# Altium project FEEL_2021.PrjPcb
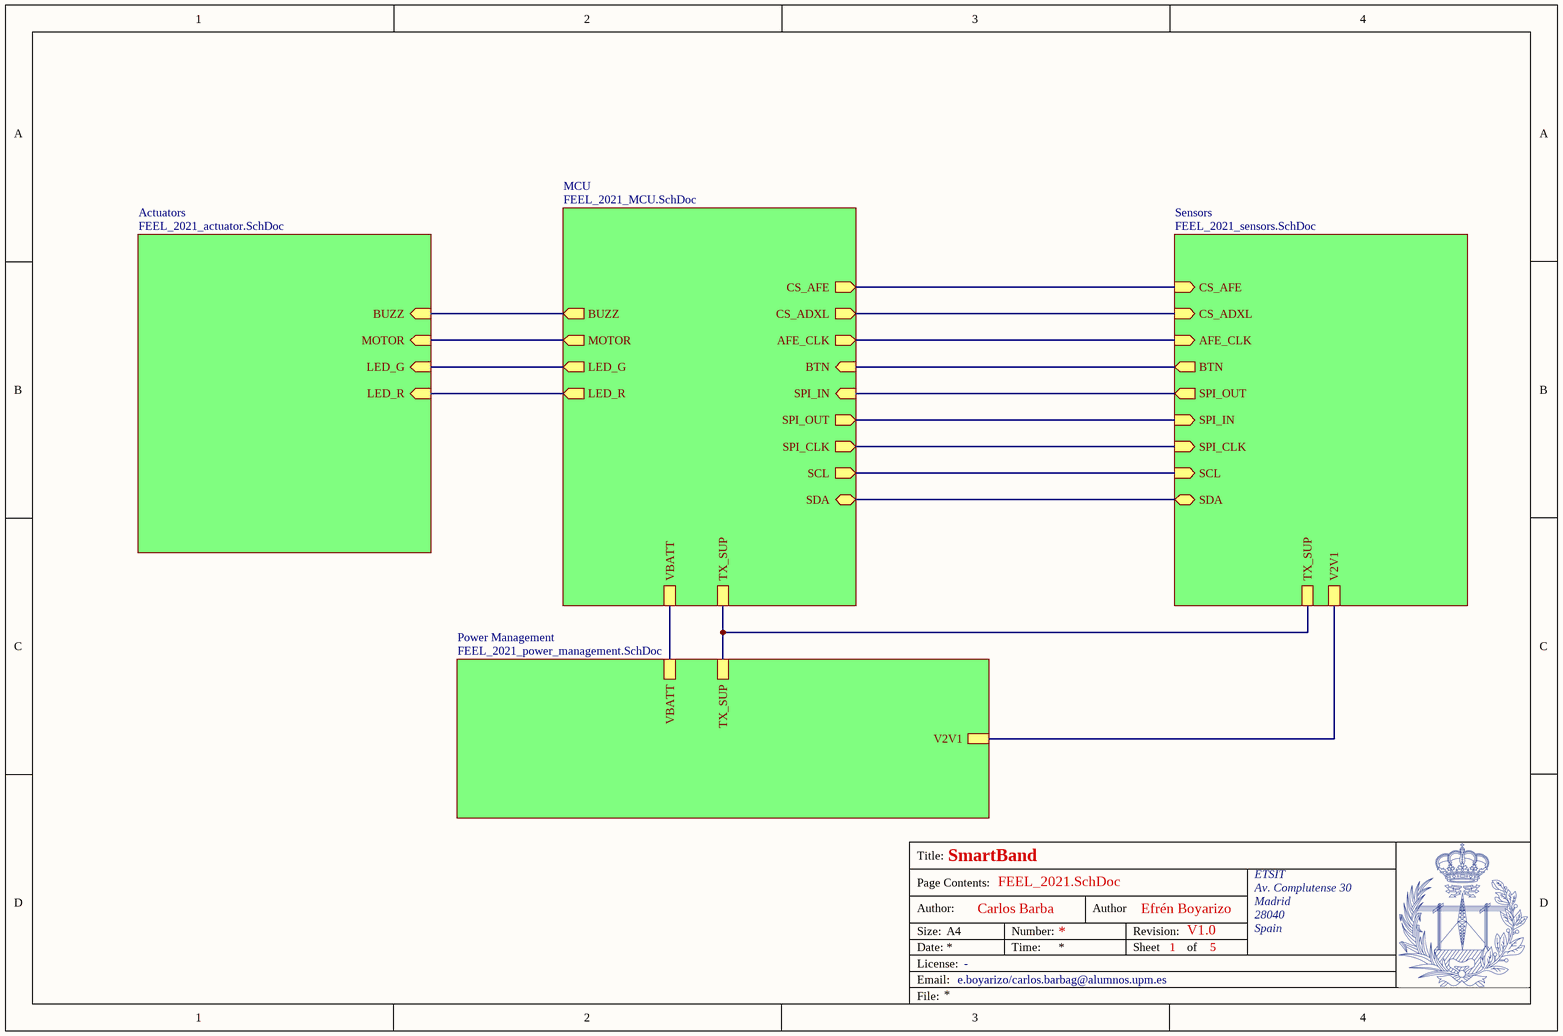
[diagram p0: FEEL_2021.SchDoc]
5 sheets, 64 parts. Net scope: hierarchical (ports join the sheet entries above them; power ports are global).
Board file: FEEL_2021.PcbDoc
Sheets:
  FEEL_2021.SchDoc
    Power Management = FEEL_2021_power_management.SchDoc
    MCU = FEEL_2021_MCU.SchDoc
    Sensors = FEEL_2021_sensors.SchDoc
    Actuators = FEEL_2021_actuator.SchDoc

## Sheet FEEL_2021.SchDoc: FEEL 2021
size A4; CheckedBy: -; Author: Carlos Barba, Efrén Boyarizo; CompanyName: ETSIT; DrawnBy: -; Revision: V1.0; SheetNumber: 1; SheetTotal: 5

### Sub-sheets
Actuators = FEEL_2021_actuator.SchDoc: MOTOR (in), LED_G (in), LED_R (in), BUZZ (in)
MCU = FEEL_2021_MCU.SchDoc: SDA (bidir), SCL (out), SPI_CLK (out), SPI_OUT (out), SPI_IN (in), AFE_CLK (out), CS_ADXL (out), VBATT, TX_SUP, BTN (in), LED_G (out), LED_R (out), MOTOR (out), BUZZ (out), CS_AFE (out)
Power Management = FEEL_2021_power_management.SchDoc: TX_SUP, VBATT, V2V1
Sensors = FEEL_2021_sensors.SchDoc: SDA (bidir), SCL (in), SPI_CLK (in), SPI_IN (in), SPI_OUT (out), AFE_CLK (in), CS_ADXL (in), V2V1, BTN (out), TX_SUP, CS_AFE (in)

### Nets
VDD: sheet Power Management/V2V1, sheet Sensors/V2V1
SCL: sheet MCU/SCL, sheet Sensors/SCL
SDA: sheet MCU/SDA, sheet Sensors/SDA
SPI_CLK: sheet MCU/SPI_CLK, sheet Sensors/SPI_CLK
SPI_IN: sheet MCU/SPI_OUT, sheet Sensors/SPI_IN
SPI_OUT: sheet MCU/SPI_IN, sheet Sensors/SPI_OUT
TX_SUP: sheet Power Management/TX_SUP, sheet MCU/TX_SUP, sheet Sensors/TX_SUP
NetADXL1_8: sheet MCU/CS_ADXL, sheet Sensors/CS_ADXL
NetBUZZ1_1: sheet MCU/BUZZ, sheet Actuators/BUZZ
NetC1_2: sheet Power Management/VBATT, sheet MCU/VBATT
NetM1_1: sheet MCU/MOTOR, sheet Actuators/MOTOR
NetMCU1_15: sheet MCU/AFE_CLK, sheet Sensors/AFE_CLK
NetMCU1_16: sheet MCU/CS_AFE, sheet Sensors/CS_AFE
NetMCU1_21: sheet MCU/BTN, sheet Sensors/BTN
NetMCU1_24: sheet MCU/LED_G, sheet Actuators/LED_G
NetMCU1_25: sheet MCU/LED_R, sheet Actuators/LED_R

### Notes on the sheet
- Title:
- SmartBand
- Author:
- Page Contents:
- Carlos Barba
- Author
- Efrén Boyarizo
- V1.0
- ETSIT
- Av. Complutense 30
- Madrid
- 28040
- Size:
- Date:
- File:
- License:
- Email:
- A4
- e.boyarizo/carlos.barbag@alumnos.upm.es
- -
- Number:
- Time:
- Revision:
- Sheet
- of
- 5
- Spain

## Sheet FEEL_2021_power_management.SchDoc
size A4; SheetNumber: 2; SheetTotal: 5
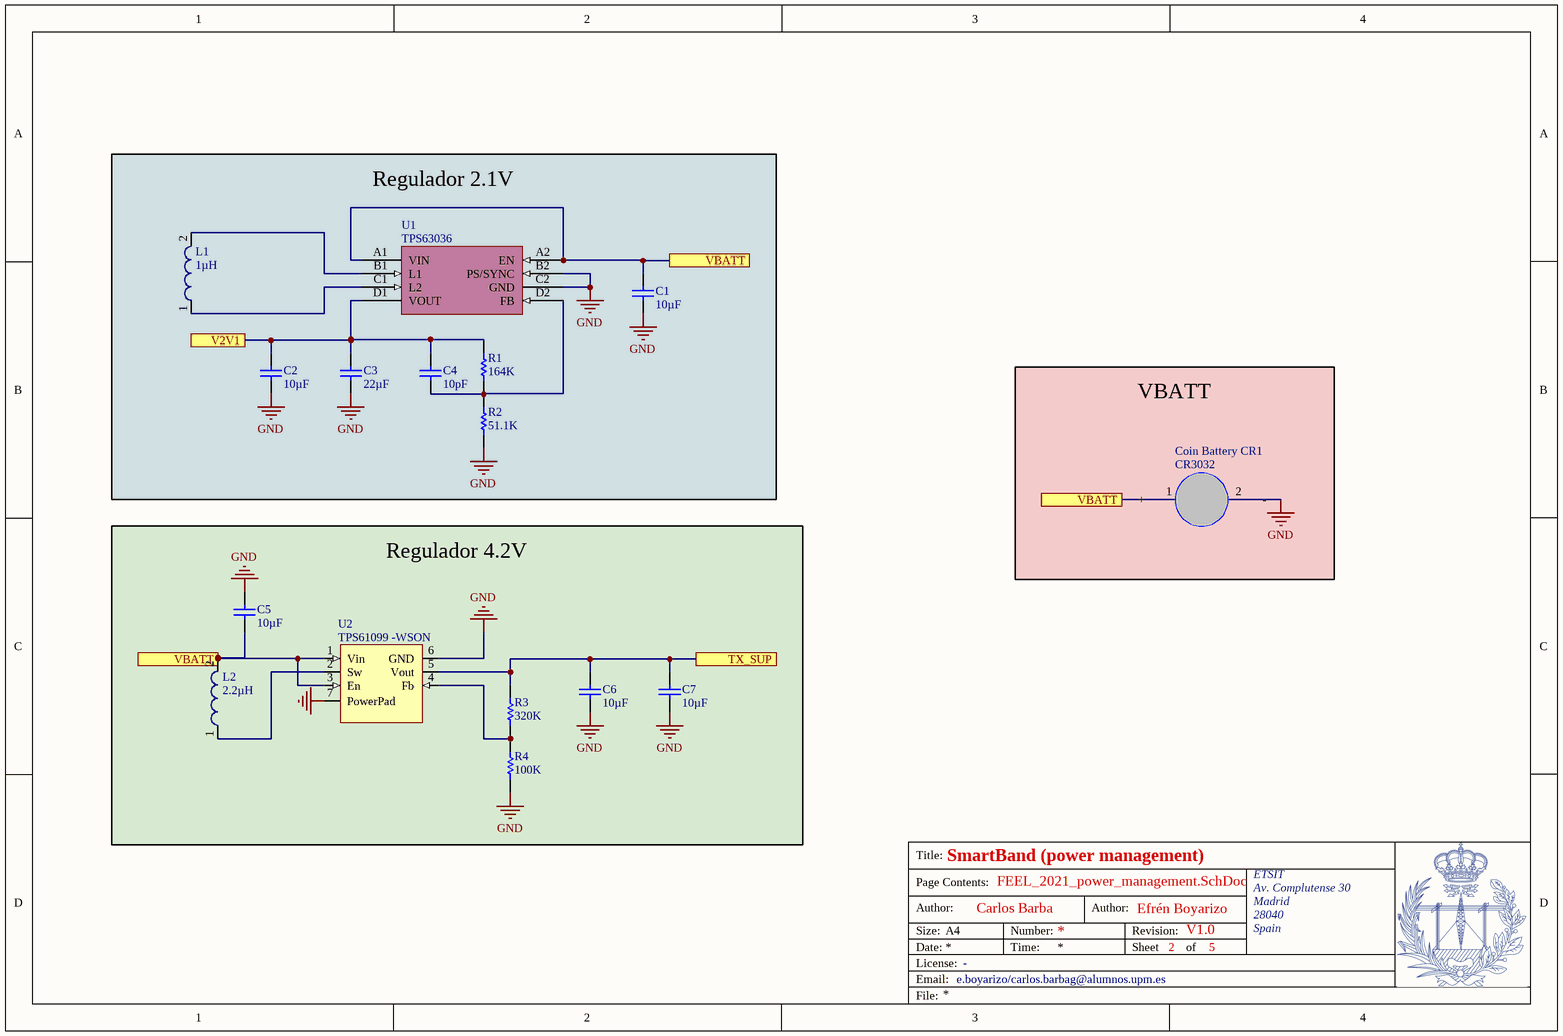
[diagram p1: FEEL_2021_power_management.SchDoc]

### Parts
C1  10µF  [CAPC1608X90X35ML10T15]
C2  10µF  [CAPC1608X90X35ML10T15]
C3  22µF  [CAPC1608X90X35ML10T15]
C4  10pF  [CAPC1608X90X35ML10T15]
C5  10µF  [CAPC1608X90X35ML10T15]
C6  10µF  [CAPC1608X90X35ML10T15]
C7  10µF  [CAPC1608X90X35ML10T15]
Coin_Battery_CR1  (no value)  [CR3032]
L1  1µH  [SMD 2510]
L2  2.2µH  [SMD 2510]
R1  164K  [RESC1609X50X30NL8T20]
R2  51.1K  [RESC1609X50X30NL8T20]
R3  320K  [RESC1609X50X30NL8T20]
R4  100K  [RESC1609X50X30NL8T20]
U1  (no value)  [tps63036]
U2  (no value)  [SOP6]

### Ports
TX_SUP, V2V1, VBATT

### Nets
GND: C1.1 C2.1 C3.1 C5.2 C6.1 C7.1 Coin_Battery_CR1.2(-) R2.2 R4.2 U1.B2(PS/SYNC) U1.C2(GND) U2.6(GND) U2.7(PowerPad)
VDD: C2.2 C3.2 C4.2 R1.2 U1.D1(VOUT) ; port V2V1
TX_SUP: C6.2 C7.2 R3.1 U2.5(Vout) ; port TX_SUP
NetC1_2: C1.2 C5.1 Coin_Battery_CR1.1(+) L2.2 U1.A1(VIN) U1.A2(EN) U2.1(Vin) U2.3(En) ; port VBATT
NetC4_1: C4.1 R1.1 R2.1 U1.D2(FB)
NetL1_1: L1.1 U1.C1(L2)
NetL1_2: L1.2 U1.B1(L1)
NetL2_1: L2.1 U2.2(Sw)
NetR3_2: R3.2 R4.1 U2.4(Fb)

### Notes on the sheet
- Regulador 2.1V
- (near Coin_Battery_CR1) VBATT
- Regulador 4.2V
- Title:
- SmartBand (power management)
- Author:
- Page Contents:
- Carlos Barba
- Efrén Boyarizo
- V1.0
- ETSIT
- Av. Complutense 30
- Madrid
- 28040
- Size:
- Date:
- File:
- License:
- Email:
- A4
- e.boyarizo/carlos.barbag@alumnos.upm.es
- -
- Number:
- Time:
- Revision:
- Sheet
- of
- 5
- Spain
- (in symbol TSP61099-WSON) TPS61099 -WSON

### Library data of the parts
C1-C7 = CMP-2000-04945-1: Manufacturer: Murata; Capacitance: 22pF; Tolerance (%): ±5%; Rated Voltage: 50V; Dielectric: C0G; Manufacturer URL: http://www.murata.com/; Datasheet Version: Jul-06; Package Reference: 603; Case Size/Dimension: 0603; Package Description: 2-Pin Surface Mount Device, Body 1.6 x 0.8 mm; Datasheet URL: https://datasheet.ciiva.com/11786/0900766b807a1cab-11786398.pdf
Coin_Battery_CR1 = CR3032
L1 L2 = CMP-1411-00017-1: Power Multilayer Inductor WE-MAPI, L=10.0µH; PartNumber: 74438323100; Manufacturer: Wuerth Elektronik; Inductance: 10.0ÂµH; ComponentLink1URL: http://www.we-online.com; ComponentLink2Description: Datasheet; ComponentLink1Description: Manufacturer URL; PackageReference: SMD 2510; ComponentLink2URL: http://katalog.we-online.de/kataloge/eisos/media/pdf/74438323100.pdf
R1-R4 = CMP-2000-03816-5: Chip Resistor, 0 Ohm, Jumper, 100 mW, -55 to 155 degC, 0603 (1608 Metric), RoHS, Tape and Reel; Manufacturer: Vishay Semiconductor; Voltage Rating: 75 V; Package Quantity: 5000; DatasheetVersion: 06/2012; Min Operating Temperature: -55 degC; ComponentLink1URL: http://www.vishay.com/; Mounting Technology: Surface Mount; Height: 0.45 mm; ComponentLink1Description: Manufacturer URL; REACH SVHC: Unknown; PackageReference: 0603; Packaging: Tape and Reel; Max Operating Temperature: 155 degC; Mount: Surface Mount; ComponentLink2Description: Datasheet; PackageDescription: 2-Pin Surface Mount Device, Body 1.575 x 0.85 mm; Length: 1.55 mm; ComponentLink2URL: http://www.vishay.com/docs/20035/dcrcwe3.pdf; Pins: 2; RoHSCompliant: true
U1 = TPS63036: Non-inverting buck-boost / converter able to provide a regulated output voltage / from an input supply that can be higher or lower than / the output voltage
U2 = TSP61099-WSON

## Sheet FEEL_2021_MCU.SchDoc
size A4; SheetNumber: 3; SheetTotal: 5
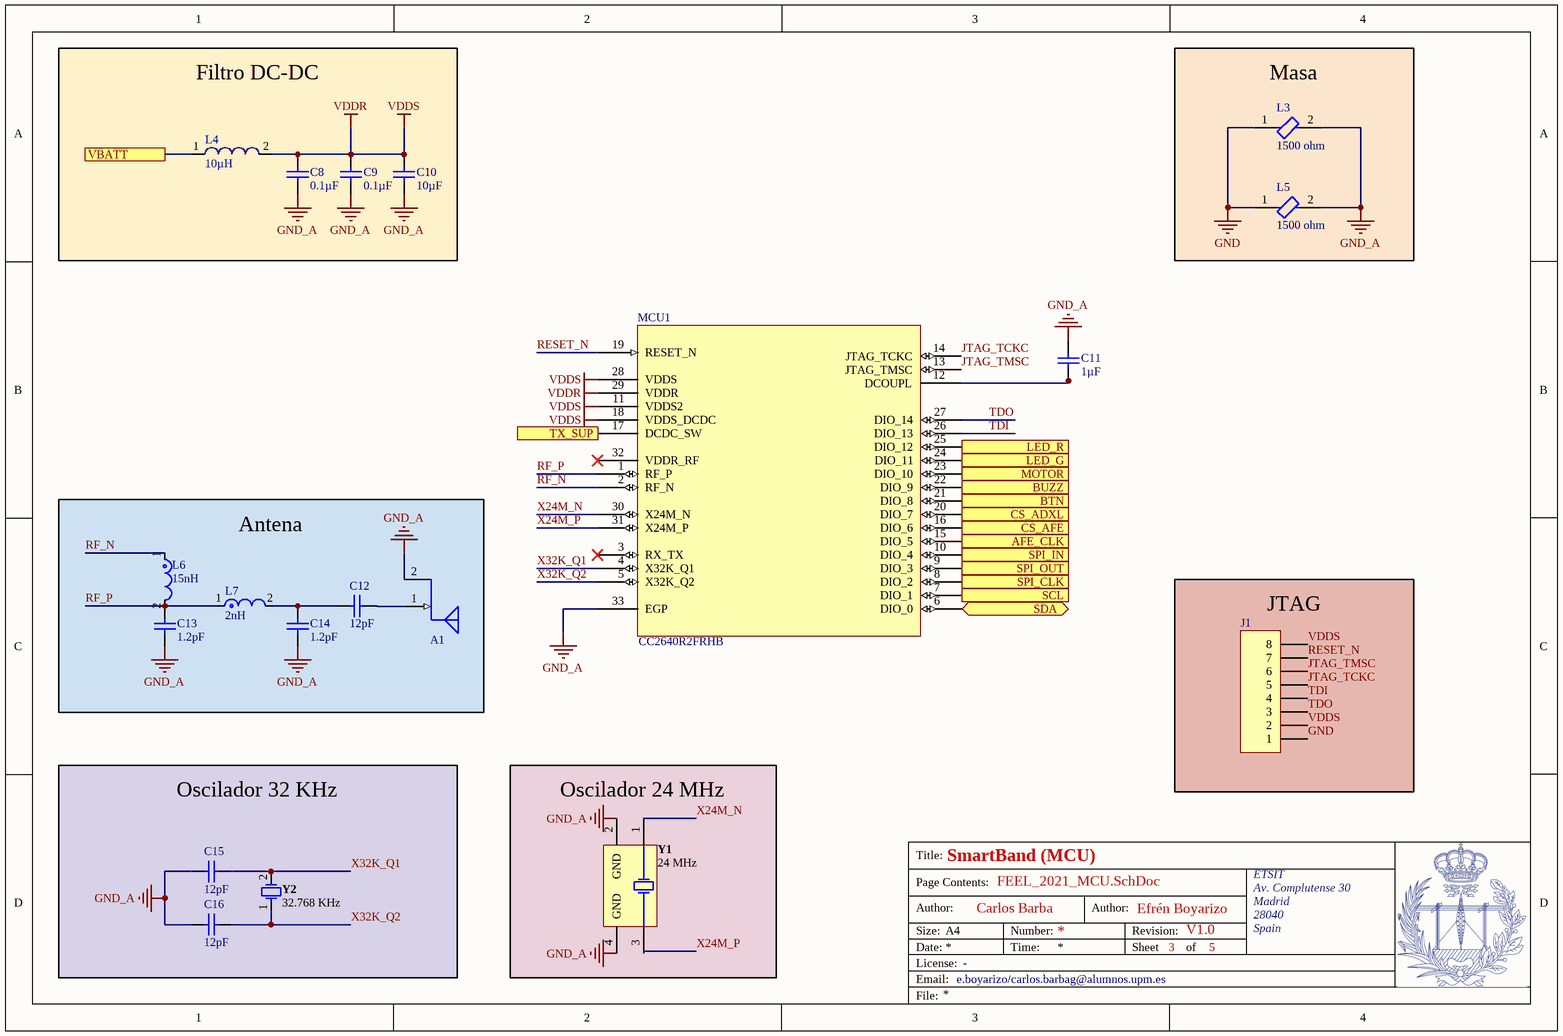
[diagram p2: FEEL_2021_MCU.SchDoc]

### Parts
A1  -  [PCBAntenna]  (value not drawn)  (net tie, no BOM)
C8  0.1µF  [CAPC1608X90X35ML10T15]
C9  0.1µF  [CAPC1608X90X35ML10T15]
C10  10µF  [CAPC1608X90X35ML10T15]
C11  1µF  [CAPC1608X90X35ML10T15]
C12  12pF  [CAPC1608X90X35ML10T15]
C13  1.2pF  [CAPC1608X90X35ML10T15]
C14  1.2pF  [CAPC1608X90X35ML10T15]
C15  12pF  [CAPC1608X90X35ML10T15]
C16  12pF  [CAPC1608X90X35ML10T15]
J1  (no value)  [HDR1X8]
L3  1500 ohm  [FP-BLM18-0_15-t0_8-MFG]
L4  10µH  [SMD 2510]
L5  1500 ohm  [FP-BLM18-0_15-t0_8-MFG]
L6  15nH  [FP-LQG15HH_02-IPC_B]
L7  2nH  [FP-LQG15HH_02-IPC_B]
MCU1  (no value)  [DEOP2021-Calle-Payno]
Y1  24 MHz  [ABRA-ABM3B-4_V]
Y2  32.768 KHz  [ABRA-ABS07_A_V]

### Ports
AFE_CLK (out), BTN (in), BUZZ (out), CS_ADXL (out), CS_AFE (out), LED_G (out), LED_R (out), MOTOR (out), SCL (out), SDA (bidir), SPI_CLK (out), SPI_IN (in), SPI_OUT (out), TX_SUP, VBATT

### Nets
GND: J1.1 L3.1 L5.1
GND_A: A1.2(GND) C8.1 C9.1 C10.1 C11.2 C13.1 C14.1 C15.1 C16.1 L3.2 L5.2 MCU1.33(EGP) Y1.2(GND) Y1.4(GND)
VDDS: C8.2 C9.2 C10.2 J1.2 J1.8 L4.2 MCU1.11(VDDS2) MCU1.18(VDDS_DCDC) MCU1.28(VDDS) MCU1.29(VDDR)  [also labelled VDDR]
JTAG_TCKC: J1.5 MCU1.14(JTAG_TCKC)
JTAG_TMSC: J1.6 MCU1.13(JTAG_TMSC)
RESET_N: J1.7 MCU1.19(RESET_N)
RF_N: L6.1 MCU1.2(RF_N)
RF_P: C13.2 L6.2 L7.1 MCU1.1(RF_P)
SCL: MCU1.7(DIO_1) ; port SCL
SDA: MCU1.6(DIO_0) ; port SDA
SPI_CLK: MCU1.8(DIO_2) ; port SPI_CLK
SPI_IN: MCU1.9(DIO_3) ; port SPI_OUT
SPI_OUT: MCU1.10(DIO_4) ; port SPI_IN
TDI: J1.4 MCU1.26(DIO_13)
TDO: J1.3 MCU1.27(DIO_14)
TX_SUP: MCU1.17(DCDC_SW) ; port TX_SUP
X24M_N: MCU1.30(X24M_N) Y1.1(X1)
X24M_P: MCU1.31(X24M_P) Y1.3(X2)
X32K_Q1: C15.2 MCU1.4(X32K_Q1) Y2.2
X32K_Q2: C16.2 MCU1.5(X32K_Q2) Y2.1
NetA1_1: A1.1(FeedPoint) C12.2
NetADXL1_8: MCU1.20(DIO_7) ; port CS_ADXL
NetBUZZ1_1: MCU1.22(DIO_9) ; port BUZZ
NetC1_2: L4.1 ; port VBATT
NetC11_1: C11.1 MCU1.12(DCOUPL)
NetC12_1: C12.1 C14.2 L7.2
NetM1_1: MCU1.23(DIO_10) ; port MOTOR
NetMCU1_15: MCU1.15(DIO_5) ; port AFE_CLK
NetMCU1_16: MCU1.16(DIO_6) ; port CS_AFE
NetMCU1_21: MCU1.21(DIO_8) ; port BTN
NetMCU1_24: MCU1.24(DIO_11) ; port LED_G
NetMCU1_25: MCU1.25(DIO_12) ; port LED_R

Not connected (* = marked no-connect by the designer): MCU1 3(RX_TX)* 32(VDDR_RF)*

### Notes on the sheet
- Filtro DC-DC
- Masa
- Antena
- (near J1) JTAG
- Title:
- SmartBand (MCU)
- Author:
- Page Contents:
- Carlos Barba
- Efrén Boyarizo
- V1.0
- ETSIT
- Av. Complutense 30
- Madrid
- 28040
- Oscilador 32 KHz
- (near Y1) Oscilador 24 MHz
- Size:
- Date:
- File:
- License:
- Email:
- A4
- e.boyarizo/carlos.barbag@alumnos.upm.es
- -
- Number:
- Time:
- Revision:
- Sheet
- of
- 5
- Spain

### Library data of the parts
A1 = PCBAntenna: GND pin has a via to a GND plane that is not included in the footprint, but has to be included in the final PCB layout design.
C8-C16 = CMP-2000-04945-1: Chip Capacitor, 22 pF, +/- 5%, 50 V, -55 to 125 degC, 0603 (1608 Metric), RoHS, Tape and Reel; Manufacturer: Murata; Capacitance: 22pF; Rated Voltage: 50V; Dielectric: C0G; Manufacturer URL: http://www.murata.com/; Datasheet Version: Jul-06; Package Reference: 603; Tolerance (%): ±5%; Case Size/Dimension: 0603; Package Description: 2-Pin Surface Mount Device, Body 1.6 x 0.8 mm; Datasheet URL: https://datasheet.ciiva.com/11786/0900766b807a1cab-11786398.pdf
J1 = Header 8: Header, 8-Pin; LatestRevisionDate: 17-Jul-2002; LatestRevisionNote: Re-released for DXP Platform.; Publisher: Altium Limited
L3 L5 = CMP-0686-00354-3: Chip Ferrite Bead, 0603, 600Ω @ 100MHz, 0.35Ω, 25%, 500mA; Manufacturer Series: BLM18E; Number of Lines: 1; DC Resistance (DCR): 350mR; Impedance: 600R; Material: Steel; Shielding: Unshielded; Package Quantity: 1; Case/Package: 0603; Length: 1.6mm; Packaging: Tape and Reel; Resistance: 350mR; REACH SVHC: No SVHC; Military Standard: Not; Contact Plating: Tin; Termination: SMD/SMT; Number of Circuits: 1; Width: 0.8mm; Test Frequency: 100MHz; DC Current: 500mA; Case Code (Metric): 1608; Max DC Current: 500mA; Max Operating Temperature: 125°C; Current Rating: 500mA; Series: BLM18E; Tolerance: 25%; Min Operating Temperature: -55°C; Frequency: 100MHz; Lead Free: Lead Free; Terminal Finish: Tin; Number of Pins: 2; Max Current Rating: 500mA; Radiation Hardening: No; Case Code (Imperial): 0603; Number of Functions: 1; Depth: 0.8mm; DC Resistance-Max: 350mR; Height: 0.8mm; Core Material: Ferrite; RoHS Compliant: Yes
L4 = CMP-1411-00017-1: as L1 on sheet FEEL_2021_power_management; ComponentLink1URL: http://www.we-online.com; ComponentLink2Description: Datasheet; ComponentLink1Description: Manufacturer URL; PackageReference: SMD 2510; ComponentLink2URL: http://katalog.we-online.de/kataloge/eisos/media/pdf/74438323100.pdf
L6 L7 = CMP-06042-001992-1: Multilayer type RF Inductor 2.4nH ±0.3nH 0.1Ω 800mA 0402; Current Rating: 300mA; Core Material: Air; Test Frequency: 100MHz; Q Factor: 8; Tolerance: 5%; Shielding: Unshielded; Self Resonant Frequency: 6GHz; DC Resistance (DCR): 160mR; Termination: SMD/SMT; Case Code (Metric): 1005; Current: 300mA; Inductance: 2.4nH; Min Operating Temperature: -55°C; Case/Package: 0402; Height - Seated (Max): 0.022inch; Length: 1mm; REACH SVHC: No SVHC; Case Code (Imperial): 0402; Package Quantity: 10000; Max DC Current: 300mA; DC Current: 300mA; Lead Free: Lead Free; Packaging: Tape and Reel; Width: 0.5mm; Height: 0.5mm; Mount: Surface Mount; Max Operating Temperature: 125°C; Military Standard: Not; Number of Pins: 2; Depth: 0.55mm; Radiation Hardening: No
MCU1 = CC2640R2FRHB
Y1 = CMP-1688-00008-1: Ceramic SMD Crystal, 24 MHz, +/- 20 ppm, 50 Ohm, -20 to 70 degC, 4-Pin SMD, RoHS, Tape and Reel; Impedance: 50 Ohm; Mating Cycles: 30; Frequency: 6 Hz; Contact Material: Brass; Contact Plating: Gold; PackageReference: ABM3B; Min Operating Temperature: -40 degC; ComponentLink2Description: Datasheet; Radiation Hardening: No; DatasheetVersion: Aug-15; Packaging: Tape and Reel; Length: 2.6 mm; Package Quantity: 2500; REACH SVHC: Unknown; PackageDescription: 4-Pin Surface Mount Device, Body 5 x 3.2 mm; Weight: 0.001058 oz; ComponentLink2URL: http://www.abracon.com/Resonators/abm3b.pdf; ComponentLink1Description: Manufacturer URL; Width: 3 mm; RoHSCompliant: true; Fastening Type: Snap; Max Operating Temperature: 155 degC; ComponentLink1URL: http://www.abracon.com/; Height: 1.244 mm; Mount: Surface Mount
Y2 = CMP-2000-07587-1: Tuning Fork Crystal, 32.768 KHz, +/- 20 ppm, -40 to 85 degC, 2-Pin SMD, RoHS, Tape and Reel; Manufacturer: Abracon; Case\/Package: SMD/SMT; Series Resistance: 60KOhm; Frequency Tolerance: 20ppm; Load Capacitance: 6pF; ESR (Equivalent Series Resistance): 55KOhm; Max Operating Temperature: 85degC; Width: 0.061inch; Radiation Hardening: No; Lead Free: LeadFree; RoHSCompliant: True; Depth: 1.5mm; Datasheet URL: http://www.abracon.com/Resonators/ABS07-120-32.768kHz-T.pdf; Frequency: 32.768KHz; Termination: SMD/SMT; Manufacturer URL: http://www.abracon.com/; Package Quantity: 3000; Packaging: TapeandReel; Number of Pins: 2; Height: 0.035inch; Package Description: 2-Pin Surface Mount Device, Body 3.2 x 1.5 mm; Package Reference: ABS07; Mount: SurfaceMount; Tolerance: 20ppm; Mounting Technology: SurfaceMount; REACH SVHC: NoSVHC; Datasheet Version: 11/2014; Length: 3.2mm; Min Operating Temperature: -40degC

## Sheet FEEL_2021_sensors.SchDoc
size A4; SheetNumber: 4; SheetTotal: 5
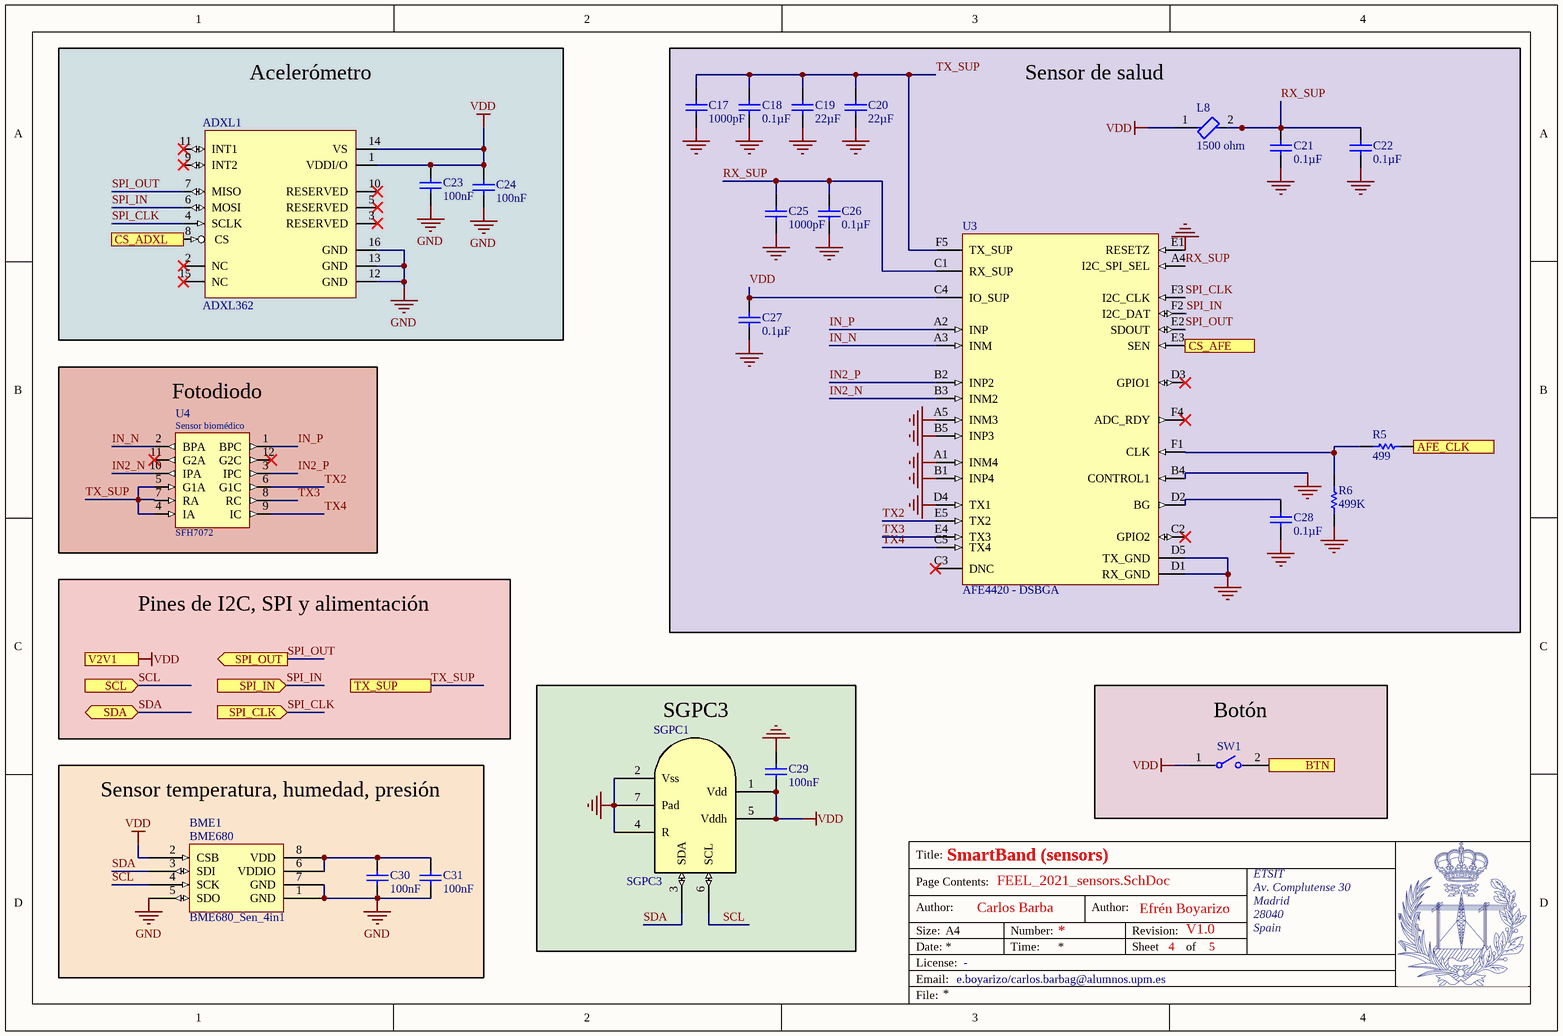
[diagram p3: FEEL_2021_sensors.SchDoc]

### Parts
ADXL1  (no value)  [ADXL362 - duplicate]
BME1  BME680_Sen_4in1  [BME_LGA8]
C17  1000pF  [CAPC1608X90X35ML10T15]
C18  0.1µF  [CAPC1608X90X35ML10T15]
C19  22µF  [CAPC1608X90X35ML10T15]
C20  22µF  [CAPC1608X90X35ML10T15]
C21  0.1µF  [CAPC1608X90X35ML10T15]
C22  0.1µF  [CAPC1608X90X35ML10T15]
C23  100nF  [CAPC1608X90X35ML10T15]
C24  100nF  [CAPC1608X90X35ML10T15]
C25  1000pF  [CAPC1608X90X35ML10T15]
C26  0.1µF  [CAPC1608X90X35ML10T15]
C27  0.1µF  [CAPC1608X90X35ML10T15]
C28  0.1µF  [CAPC1608X90X35ML10T15]
C29  100nF  [CAPC1608X90X35ML10T15]
C30  100nF  [CAPC1608X90X35ML10T15]
C31  100nF  [CAPC1608X90X35ML10T15]
L8  1500 ohm  [FP-BLM18-0_15-t0_8-MFG]
R5  499  [RESC1609X50X30NL8T20]
R6  499K  [RESC1609X50X30NL8T20]
SGPC1  SGPC3  [DFN 6-pin]
SW1  (no value)  [FP-B3U-1000P-MFG]
U3  AFE4420 - DSBGA  [AFE4420 - DSBGA]
U4  (no value)  [SFH7072]

### Ports
AFE_CLK (in), BTN (out), CS_ADXL (in), CS_AFE (in), SCL (in), SDA (bidir), SPI_CLK (in), SPI_IN (in), SPI_OUT (out), TX_SUP, V2V1

### Nets
GND: ADXL1.12(GND) ADXL1.13(GND) ADXL1.16(GND) BME1.1(GND) BME1.5(SDO) BME1.7(GND) C17.1 C18.1 C19.1 C20.1 C21.1 C22.1 C23.1 C24.1 C25.1 C26.1 C27.1 C28.1 C29.2 C30.1 C31.1 R6.1 SGPC1.2(Vss) SGPC1.4(R) SGPC1.7(Pad) U3.A1(INM4) U3.A5(INM3) U3.B1(INP4) U3.B4(CONTROL1) U3.B5(INP3) U3.D1(RX_GND) U3.D4(TX1) U3.D5(TX_GND) U3.E1(RESETZ)
VDD: ADXL1.1(VDDI/O) ADXL1.14(VS) BME1.2(CSB) C23.2 C24.2 C27.2 C29.1 L8.1 SGPC1.1(Vdd) SGPC1.5(Vddh) SW1.1 U3.C4(IO_SUP) ; port V2V1
IN2_N: U3.B3(INM2) U4.10(IPA)
IN2_P: U3.B2(INP2) U4.3(IPC)
IN_N: U3.A3(INM) U4.2(BPA)
IN_P: U3.A2(INP) U4.1(BPC)
RX_SUP: C21.2 C22.2 C25.2 C26.2 L8.2 U3.A4(I2C_SPI_SEL) U3.C1(RX_SUP)
SCL: BME1.4(SCK) SGPC1.6(SCL) ; port SCL
SDA: BME1.3(SDI) SGPC1.3(SDA) ; port SDA
SPI_CLK: ADXL1.4(SCLK) U3.F3(I2C_CLK) ; port SPI_CLK
SPI_IN: ADXL1.6(MOSI) U3.F2(I2C_DAT) ; port SPI_IN
SPI_OUT: ADXL1.7(MISO) U3.E2(SDOUT) ; port SPI_OUT
TX2: U3.E5(TX2) U4.6(G1C)
TX3: U3.E4(TX3) U4.8(RC)
TX4: U3.C5(TX4) U4.9(IC)
TX_SUP: C17.2 C18.2 C19.2 C20.2 U3.F5(TX_SUP) U4.4(IA) U4.5(G1A) U4.7(RA) ; port TX_SUP
NetADXL1_8: ADXL1.8(CS) ; port CS_ADXL
NetBME1_6: BME1.6(VDDIO) BME1.8(VDD) C30.2 C31.2
NetC28_2: C28.2 U3.D2(BG)
NetMCU1_15: R5.1 ; port AFE_CLK
NetMCU1_16: U3.E3(SEN) ; port CS_AFE
NetMCU1_21: SW1.2 ; port BTN
NetR5_2: R5.2 R6.2 U3.F1(CLK)

Not connected (* = marked no-connect by the designer): ADXL1 2(NC)* 3(RESERVED)* 5(RESERVED)* 9(INT2)* 10(RESERVED)* 11(INT1)* 15(NC)*; U3 C2(GPIO2)* C3(DNC)* D3(GPIO1)* F4(ADC_RDY)*; U4 11(G2A)* 12(G2C)*

### Notes on the sheet
- Acelerómetro
- (near U4) Fotodiodo
- Sensor de salud
- Pines de I2C, SPI y alimentación
- Title:
- SmartBand (sensors)
- (near SW1) Botón
- Author:
- Page Contents:
- Carlos Barba
- Efrén Boyarizo
- V1.0
- ETSIT
- Av. Complutense 30
- Madrid
- 28040
- Sensor temperatura, humedad, presión
- SGPC3
- Size:
- Date:
- File:
- License:
- Email:
- A4
- e.boyarizo/carlos.barbag@alumnos.upm.es
- -
- Number:
- Time:
- Revision:
- Sheet
- of
- 5
- Spain
- (in symbol BME680_Sen_4in1) BME680
- (in symbol SFH7072) Sensor biomédico

### Library data of the parts
ADXL1 = ADXL362
C17-C31 = CMP-2000-04945-1: as C8 on sheet FEEL_2021_MCU; Manufacturer URL: http://www.murata.com/; Datasheet Version: Jul-06; Package Reference: 603; Tolerance (%): ±5%; Case Size/Dimension: 0603; Package Description: 2-Pin Surface Mount Device, Body 1.6 x 0.8 mm; Datasheet URL: https://datasheet.ciiva.com/11786/0900766b807a1cab-11786398.pdf
L8 = CMP-0686-00354-3: as L3 on sheet FEEL_2021_MCU; Package Quantity: 1; Case/Package: 0603; Length: 1.6mm; Packaging: Tape and Reel; Resistance: 350mR; REACH SVHC: No SVHC; Military Standard: Not; Contact Plating: Tin; Termination: SMD/SMT; Number of Circuits: 1; Width: 0.8mm; Test Frequency: 100MHz; DC Current: 500mA; Case Code (Metric): 1608; Max DC Current: 500mA; Max Operating Temperature: 125°C; Current Rating: 500mA; Series: BLM18E; Tolerance: 25%; Min Operating Temperature: -55°C; Frequency: 100MHz; Lead Free: Lead Free; Terminal Finish: Tin; Number of Pins: 2; Max Current Rating: 500mA; Radiation Hardening: No; Case Code (Imperial): 0603; Number of Functions: 1; Depth: 0.8mm; DC Resistance-Max: 350mR; Height: 0.8mm; Core Material: Ferrite; RoHS Compliant: Yes
R5 R6 = CMP-2000-03816-5: as R1 on sheet FEEL_2021_power_management; Package Quantity: 5000; DatasheetVersion: 06/2012; Min Operating Temperature: -55 degC; ComponentLink1URL: http://www.vishay.com/; Mounting Technology: Surface Mount; Height: 0.45 mm; ComponentLink1Description: Manufacturer URL; REACH SVHC: Unknown; PackageReference: 0603; Packaging: Tape and Reel; Max Operating Temperature: 155 degC; Mount: Surface Mount; ComponentLink2Description: Datasheet; PackageDescription: 2-Pin Surface Mount Device, Body 1.575 x 0.85 mm; Length: 1.55 mm; ComponentLink2URL: http://www.vishay.com/docs/20035/dcrcwe3.pdf; Pins: 2; RoHSCompliant: true
SGPC1 = SGPC3: Indoor Air Quality Sensor for TVOC Measurements
SW1 = CMP-2100-03586-2: SWITCH TACTILE SPST-NO 0.05A 12V; Contact Resistance: 100mR; Operating Force: 1.5N; Max Current Rating: 50mA; Switch Travel: 0.15mm; Actuator Type: Standard; Mechanical Life: 200000Cycles; Ratings: Dust Proof; Illumination Type: Non-Illuminated; Throw Configuration: SPST; Actuator Length: 0.4mm; Switch Function: Off-Mom; Height: 1.2mm; Width: 3mm; Weight: 0.000776oz; Contact Material: Silver; Max Voltage Rating (DC): 12V; Insulation Resistance: 100MR; Lead Free: Lead Free; Current Rating: 50mA; Termination: SMD/SMT; Length: 4mm; Voltage Rating (DC): 12V; Contact Current Rating: 50mA; Orientation: Straight; Depth: 2.5mm; Max Operating Temperature: 70°C; Packaging: Tape and Reel; Min Operating Temperature: -25°C; Package Quantity: 1; Mount: Surface Mount; Electrical Life: 200000Cycles
U4 = SFH7072: Sensor biométrico

## Sheet FEEL_2021_actuator.SchDoc
size A4; SheetNumber: 5; SheetTotal: 5
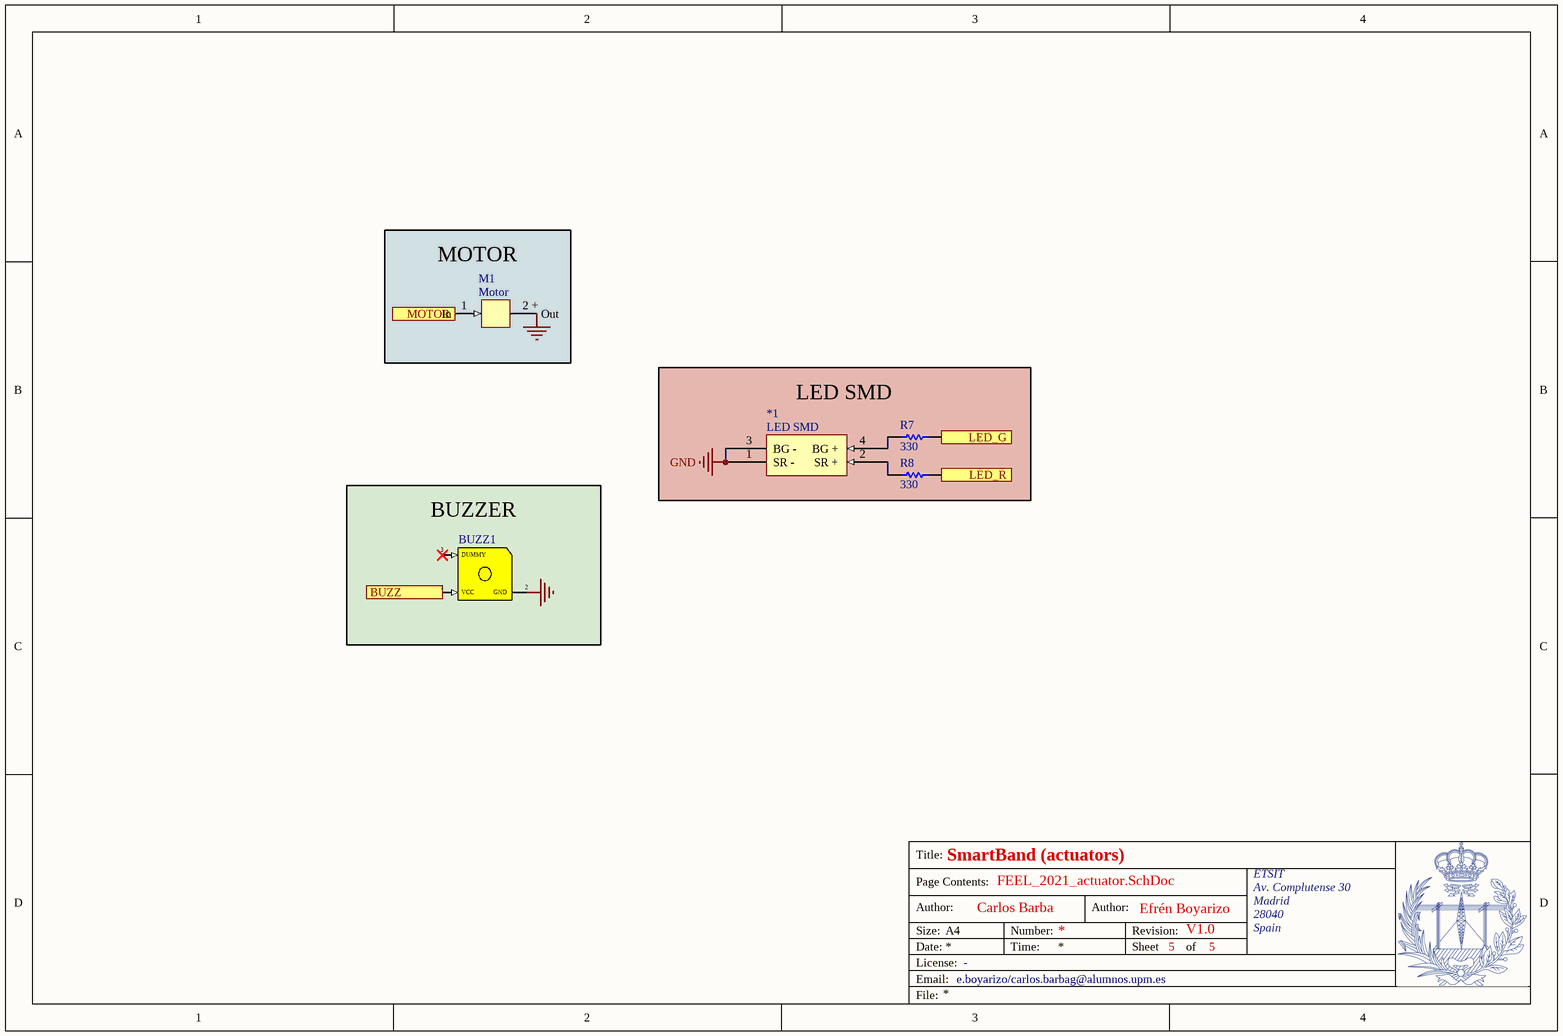
[diagram p4: FEEL_2021_actuator.SchDoc]

### Parts
*1  LED  [LED_SMD]  (value not drawn)
BUZZ1  Surface_Mount_Buzzer  [buzzer]  (value not drawn)
M1  MOTOR  [Motor]  (value not drawn)
R7  330  [RESC1609X50X30NL8T20]
R8  330  [RESC1609X50X30NL8T20]

### Ports
BUZZ (in), LED_G (in), LED_R (in), MOTOR (in)

### Nets
GND: *1.1(SR_-) *1.3(BG_-) BUZZ1.2(GND) M1.2_+(Out)
Net*1_2: *1.2(SR_+) R8.1
Net*1_4: *1.4(BG_+) R7.1
NetBUZZ1_1: BUZZ1.1(VCC) ; port BUZZ
NetM1_1: M1.1(In) ; port MOTOR
NetMCU1_24: R7.2 ; port LED_G
NetMCU1_25: R8.2 ; port LED_R

Not connected (* = marked no-connect by the designer): BUZZ1 3(DUMMY)*

### Notes on the sheet
- (near M1) MOTOR
- LED SMD
- (near BUZZ1) BUZZER
- Title:
- SmartBand (actuators)
- Author:
- Page Contents:
- Carlos Barba
- Efrén Boyarizo
- V1.0
- ETSIT
- Av. Complutense 30
- Madrid
- 28040
- Size:
- Date:
- File:
- License:
- Email:
- A4
- e.boyarizo/carlos.barbag@alumnos.upm.es
- -
- Number:
- Time:
- Revision:
- Sheet
- of
- 5
- Spain
- (in symbol LED) LED SMD
- (in symbol MOTOR) Motor

### Library data of the parts
R7 R8 = CMP-2000-03816-5: as R1 on sheet FEEL_2021_power_management; Package Quantity: 5000; DatasheetVersion: 06/2012; Min Operating Temperature: -55 degC; ComponentLink1URL: http://www.vishay.com/; Mounting Technology: Surface Mount; Height: 0.45 mm; ComponentLink1Description: Manufacturer URL; REACH SVHC: Unknown; PackageReference: 0603; Packaging: Tape and Reel; Max Operating Temperature: 155 degC; Mount: Surface Mount; ComponentLink2Description: Datasheet; PackageDescription: 2-Pin Surface Mount Device, Body 1.575 x 0.85 mm; Length: 1.55 mm; ComponentLink2URL: http://www.vishay.com/docs/20035/dcrcwe3.pdf; Pins: 2; RoHSCompliant: true

## Nets that join several sheets
GND: FEEL_2021_power_management (13 pins), FEEL_2021_MCU (J1.1 L3.1 L5.1), FEEL_2021_sensors (34 pins), FEEL_2021_actuator (*1.1 *1.3 BUZZ1.2 M1.2 +)
VDD: FEEL_2021_power_management (5 pins), FEEL_2021_sensors (12 pins)
NetADXL1_8: FEEL_2021_MCU (MCU1.20), FEEL_2021_sensors (ADXL1.8)
NetBUZZ1_1: FEEL_2021_MCU (MCU1.22), FEEL_2021_actuator (BUZZ1.1)
NetC1_2: FEEL_2021_power_management (8 pins), FEEL_2021_MCU (L4.1)
NetM1_1: FEEL_2021_MCU (MCU1.23), FEEL_2021_actuator (M1.1)
NetMCU1_15: FEEL_2021_MCU (MCU1.15), FEEL_2021_sensors (R5.1)
NetMCU1_16: FEEL_2021_MCU (MCU1.16), FEEL_2021_sensors (U3.E3)
NetMCU1_21: FEEL_2021_MCU (MCU1.21), FEEL_2021_sensors (SW1.2)
NetMCU1_24: FEEL_2021_MCU (MCU1.24), FEEL_2021_actuator (R7.2)
NetMCU1_25: FEEL_2021_MCU (MCU1.25), FEEL_2021_actuator (R8.2)
SCL: FEEL_2021_MCU (MCU1.7), FEEL_2021_sensors (BME1.4 SGPC1.6)
SDA: FEEL_2021_MCU (MCU1.6), FEEL_2021_sensors (BME1.3 SGPC1.3)
SPI_CLK: FEEL_2021_MCU (MCU1.8), FEEL_2021_sensors (ADXL1.4 U3.F3)
SPI_IN: FEEL_2021_MCU (MCU1.9), FEEL_2021_sensors (ADXL1.6 U3.F2)
SPI_OUT: FEEL_2021_MCU (MCU1.10), FEEL_2021_sensors (ADXL1.7 U3.E2)
TX_SUP: FEEL_2021_power_management (C6.2 C7.2 R3.1 U2.5), FEEL_2021_MCU (MCU1.17), FEEL_2021_sensors (8 pins)